# EAGLE design esp_all4 (EAGLE 7.7.0)
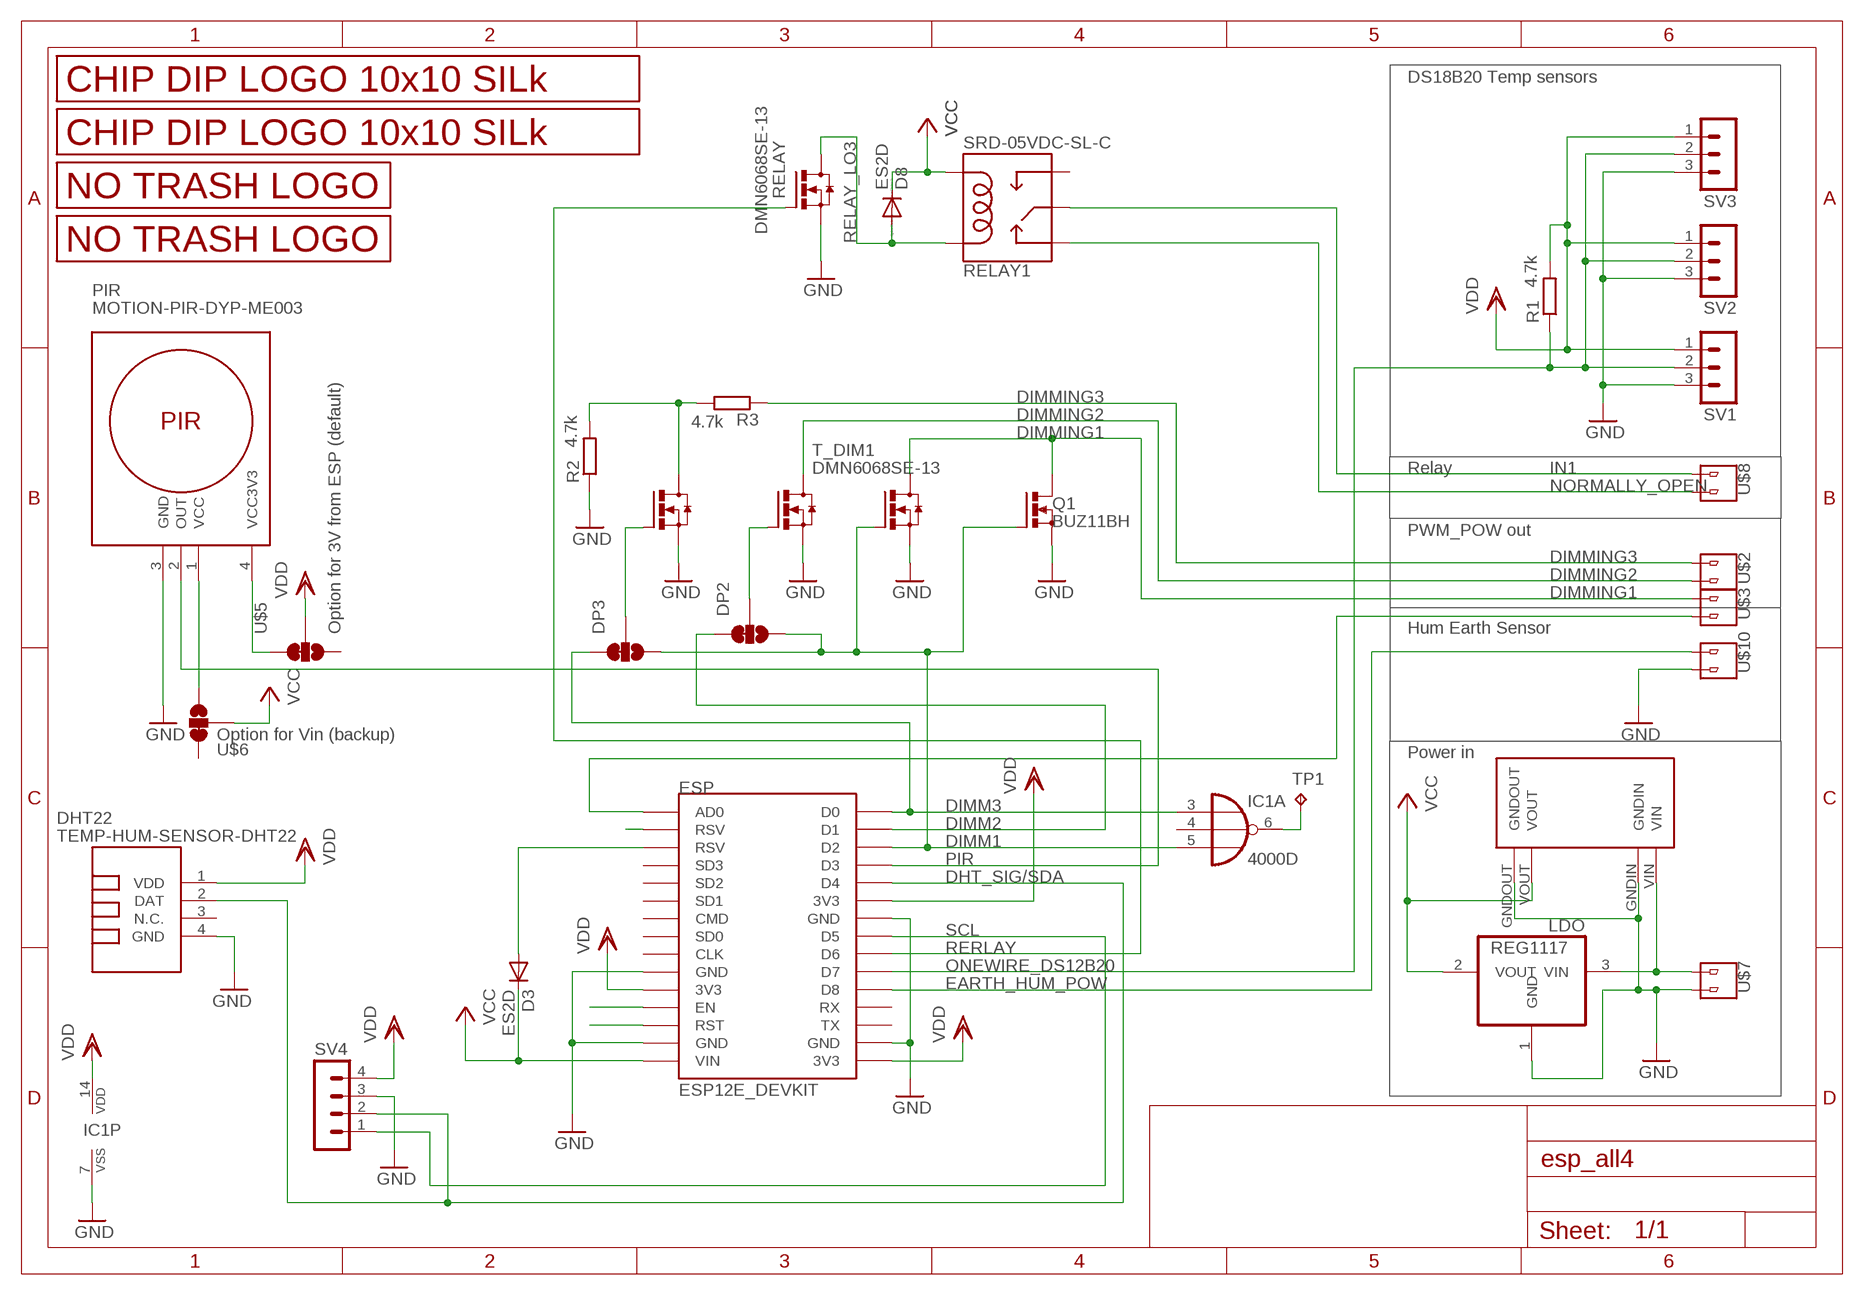
[diagram p0: schematic, sheet 1]

## Parts
D3  ES2D  [SMB]
D8  ES2D  DIODE-SMB  [SMB]
DHT22  TEMP-HUM-SENSOR-DHT22  [TEMP-HUM-SENSOR-DHT22]
DP2  SMD_SJ_3WAY_CLOSED  [SMD_SJ_3WAY_CLOSED]
DP3  SMD_SJ_3WAY_CLOSED  [SMD_SJ_3WAY_CLOSED]
ESP  ESP12E_DEVKIT  [ESP12E_DEVKIT]
IC1  4000D  [SO14]
LDO  REG1117  [SOT223]
PIR  MOTION-PIR-DYP-ME003  [MOTION-PIR-DYP-ME003]
Q1  BUZ11BH  [TO220BH]
R1  4.7k  R-EU_M0805  [M0805]
R2  4.7k  R-EU_M0805  [M0805]
R3  4.7k  R-EU_M0805  [M0805]
RELAY  DMN6068SE-13  NMOSFET_SMD_223  [SOT223]
RELAY1  SRD-05VDC-SL-C  RELAYPTH  [SRD-05VDC-SL-C]
SV1  MA03-1  [MA03-1]
SV2  MA03-1  [MA03-1]
SV3  MA03-1  [MA03-1]
SV4  MA04-1  [MA04-1]
T_DIM1  DMN6068SE-13  NMOSFET_SMD_223  [SOT223]
T_DIM2  DMN6068SE-13  NMOSFET_SMD_223  [SOT223]
T_DIM3  DMN6068SE-13  NMOSFET_SMD_223  [SOT223]
TP1  TPTP20SQ  [TP20SQ]
U$1  LOGO_10X10_SILK  [LOGO2_10X10_SILK]
U$2  V1  2_PIN_CONNECTOR  [2_SCREW_PIN]
U$3  V1  2_PIN_CONNECTOR  [2_SCREW_PIN]
U$4  LOGO_NO_TRASHNO_TRASH  [LOGO_ROHS_NO_TRASH]
U$5  SMD_SJ_3WAY_CLOSED  [SMD_SJ_3WAY_CLOSED]
U$6  SMD_SJ_3WAY_CLOSED  [SMD_SJ_3WAY_CLOSED]
U$7  V1  2_PIN_CONNECTOR  [2_SCREW_PIN]
U$8  V1  2_PIN_CONNECTOR  [2_SCREW_PIN]
U$9  LOGO_NO_TRASHROHS  [LOGO_ROHS_SYM]
U$10  V1  2_PIN_CONNECTOR  [2_SCREW_PIN]
U$11  LOGO_10X10_SILK  [LOGO2_10X10_SILK]
U$12  MP1584EN_FRAMELESS  [MP1584EN_FRAMELESS]

## Nets
DHT_SIG/SDA: DHT22.2(DAT) ESP.D4 ESP.D41(D4) SV4.2
DIMM1: DP2.3 DP3.3 ESP.D2 ESP.D21(D2) IC1.5(A:I2) Q1.G T_DIM1.1(G)
DIMM2: DP2.1 ESP.D1 ESP.D11(D1)
DIMM3: DP3.1 ESP.D0 ESP.D01(D0) IC1.3(A:I0)
DIMMING1: Q1.D T_DIM1.2(D) T_DIM1.4(D) U$3.P$1
DIMMING2: T_DIM2.2(D) T_DIM2.4(D) U$2.P$2
DIMMING3: R3.1 U$2.P$1
EARTH_HUM_POW: ESP.D8 ESP.D81(D8) U$10.P$1
GND: DHT22.4(GND) ESP.GND@0(GND) ESP.GND@1(GND) ESP.GND@2(GND) ESP.GND@3(GND) ESP.GND@4(GND) ESP.GND@5(GND) ESP.GND@6(GND) ESP.GND@7(GND) IC1.7(P:VSS) LDO.1(GND) PIR.3(GND) Q1.S R2.1 RELAY.3(S) SV1.3 SV2.3 SV3.3 SV4.3 T_DIM1.3(S) T_DIM2.3(S) T_DIM3.3(S) U$7.P$2 U$10.P$2 U$12.GNDIN U$12.GNDOUT
IN1: RELAY1.SWCOMMON U$8.P$1
N$1: ESP.AD0 ESP.AD1(AD0) U$3.P$2
N$2: ESP.RSV@0(RSV) ESP.RSV@01(RSV)
N$3: R2.2 R3.2 T_DIM3.2(D) T_DIM3.4(D)
N$4: IC1.6(A:O) TP1.TP
N$12: ESP.EN ESP.EN1(EN)
N$13: ESP.RST ESP.RST1(RST)
N$14: D3.A ESP.RSV@1(RSV) ESP.RSV@11(RSV)
N$17: LDO.3(VIN) U$7.P$1 U$12.VIN
N$20: DP3.2 T_DIM3.1(G)
N$21: DP2.2 T_DIM2.1(G)
N$24: PIR.4(VCC3V3) U$5.1
N$31: PIR.1(VCC) U$6.3
NORMALLY_OPEN: RELAY1.SWCLOSED(SWCLOSE) U$8.P$2
ONEWIRE_DS12B20: ESP.D7 ESP.D71(D7) R1.1 SV1.2 SV2.2 SV3.2
PIR: ESP.D3 ESP.D31(D3) PIR.2(OUT)
RELAY_LO3: D8.A RELAY1.COIL1 RELAY.2(D) RELAY.4(D)
RERLAY: ESP.D6 ESP.D61(D6) RELAY.1(G)
SCL: ESP.D5 ESP.D51(D5) SV4.1
VCC: D3.C D8.C ESP.VIN ESP.VIN1(VIN) LDO.2(VOUT) RELAY1.COIL0 U$6.2 U$12.VOUT
VDD: DHT22.1(VDD) ESP.3V3@0(3V3) ESP.3V3@1(3V3) ESP.3V3@2(3V3) ESP.3V3@3(3V3) ESP.3V3@4(3V3) ESP.3V3@5(3V3) IC1.14(P:VDD) R1.2 SV1.1 SV2.1 SV3.1 SV4.4 U$5.2
Unconnected: DHT22.3(N.C.) ESP.CLK ESP.CLK1(CLK) ESP.CMD ESP.CMD1(CMD) ESP.RX ESP.RX1(RX) ESP.SD0 ESP.SD1 ESP.SD01(SD0) ESP.SD2 ESP.SD3 ESP.SD12(SD1) ESP.SD22(SD2) ESP.SD32(SD3) ESP.TX ESP.TX1(TX) IC1.4(A:I1) IC1.8(C:I) IC1.9(C:O) IC1.10(B:O) IC1.11(B:I2) IC1.12(B:I1) IC1.13(B:I0) RELAY1.SWOPEN U$5.3 U$6.1

## Notes on the sheet
- DS18B20 Temp sensors
- Relay
- PWM_POW out
- Option for 3V from ESP (default) | Hum Earth Sensor
- Option for Vin (backup)
- Power in

## Library data of the parts
D3 = diode:ES2D: DIODE super fast rectifier, 2 A
D8 = diode:DIODE-: DIODE
DHT22 = diy-modules:TEMP-HUM-SENSOR-DHT22: DHT22 - digital humidity & temperature sensor Also known as: AM2302 AM2302 datasheet available here: http://akizukidenshi.com/download/ds/aosong/AM2302.pdf Click here to find device on ebay.com <http://www.ebay.com/sch/dht22+digital+sensor>
DP2 DP3 U$5 U$6 = JKW_CHIP:SMD_SJ_3WAY_CLOSED
ESP = ESP12E_DEVKIT:ESP12E_DEVKIT: ESP12E DEVKIT BOARD
IC1 = 40xx:4000: Dual 3-input NOR & INVERTER
LDO = burr-brown:REG1117: 800mA and 1A Low Dropout (LDO) Positive Regulator 1.8V, 2.5V, 2.85V, 3.3V, 5V, and Adj; MPN: REG1117; OC_FARNELL: 1097566; OC_NEWARK: 14P6981
PIR = diy-modules:MOTION-PIR-DYP-ME003: PIR Motion Sensor Module DYP-ME003 based on BISS0001 pyroelectic detector Click here to find device on ebay.com <http://www.ebay.com/sch/dyp+me003>
Q1 = transistor-power:BUZ11: N-CHANNEL MOS FET
R1-R3 = rcl:R-EU_: RESISTOR, European symbol
RELAY T_DIM1-T_DIM3 = transistor-power:NMOSFET_SMD_223
RELAY1 = JKW_CHIP:RELAY: SPDT relay (COM-00101)
SV1-SV3 = con-lstb:MA03-1: PIN HEADER; OC_FARNELL: unknown; OC_NEWARK: unknown
SV4 = con-lstb:MA04-1: PIN HEADER; OC_FARNELL: unknown; OC_NEWARK: unknown
TP1 = testpad:TP: Test pad
U$1 U$11 = JKW_CHIP:LOGO_10X10_SILK
U$2 U$3 U$7 U$8 U$10 = JKW_CHIP:2_PIN_CONNECTOR
U$4 U$9 = JKW_CHIP:LOGO_NO_TRASH
U$12 = JKW_CHIP:MP1584EN_FRAMELESS

## Board
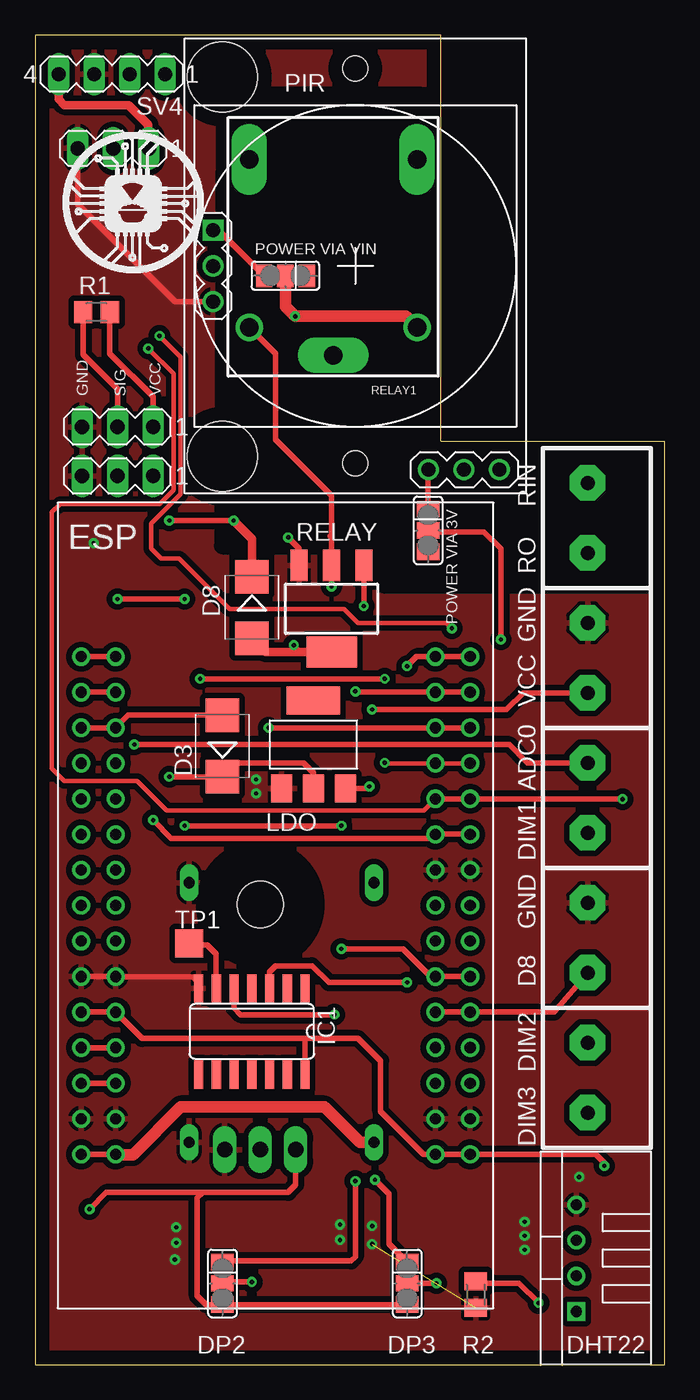
[diagram p1: board, top side]
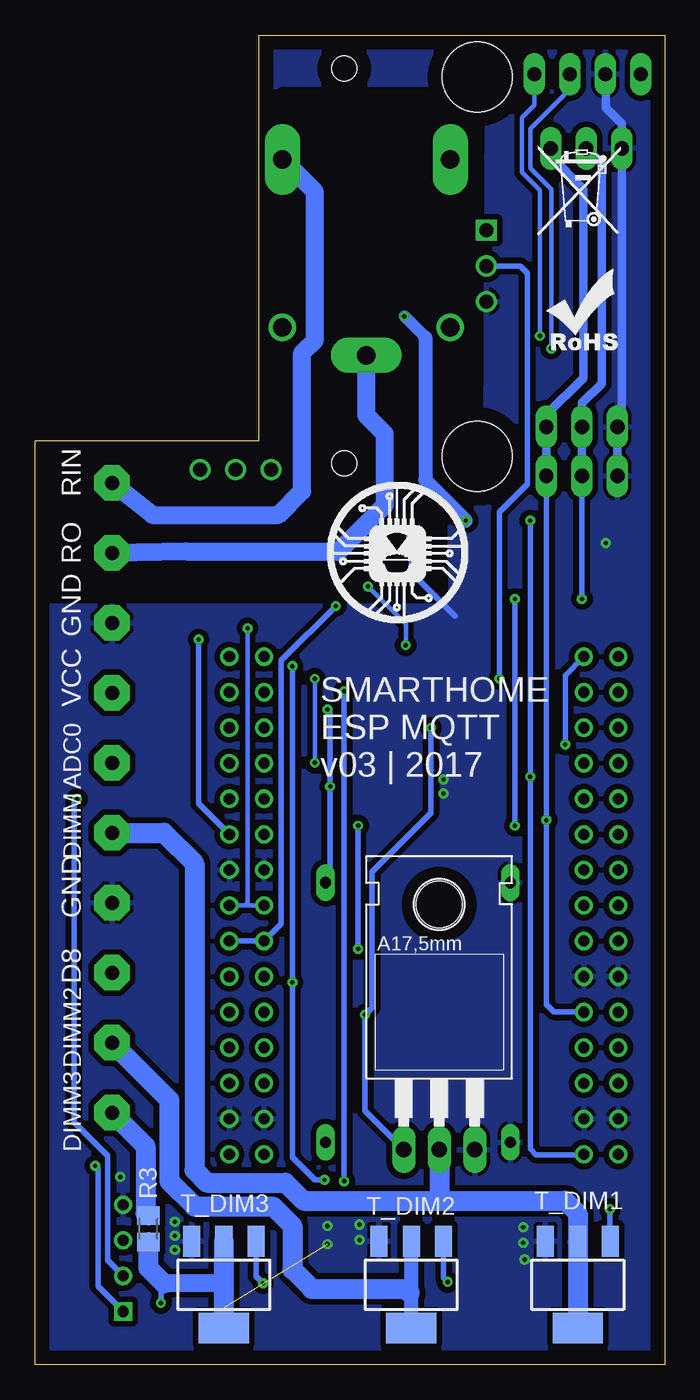
[diagram p2: board, bottom side, seen from below]

Size 45 x 95 mm. Coordinates in mm from the lower left corner, seen from the top.
Outline: 0,0 45,0 45,66 29,66 29,95 0,95 0,0
Copper layers (1*16): Top 0.035mm / dielectric 1.5mm / Bottom 0.035mm
Design rules "default": minimum track width 10mil, minimum drill 24mil, track to track 8mil, track to pad 8mil, pad to pad 8mil, via to via 8mil, smd to smd 8mil, copper to edge 40mil, drill to drill 8mil, minimum pad ring 10mil, minimum via ring 8mil, stop-mask expansion 4mil, vias tented up to drill 0mil, thermal gap 10mil
Holes 5 mm at 13.4,64.9 13.4,92
tRestrict: area 13.4,55.7 to 44.4,90.7
bRestrict: area 13.5,55 to 44.2,90.7

### Footprints (pad centres in the part's own frame; a part is rotated, then mirrored left to right if it is on the bottom)
SMB = smd 2.4 x 2.4: A 2.2,0; C -2.2,0
TEMP-HUM-SENSOR-DHT22 = drill 0.8 square: 1 -3.81,0 | drill 0.8: 2 -1.27,0; 3 1.27,0; 4 3.81,0
SMD_SJ_3WAY_CLOSED = smd 1.168 x 1.6: 1 -1.524,0; 2 0,0; 3 1.524,0
ESP12E_DEVKIT = drill 0.8: 3V3@0 -11.43,-7.62; 3V3@1 11.43,5.08; 3V3@2 11.43,-17.78; 3V3@3 -13.9,-7.62; 3V3@4 13.9,5.08; 3V3@5 13.9,-17.78; AD0 -11.43,17.78; AD1 -13.9,17.78; CLK -11.43,-2.54; CLK1 -13.9,-2.54; CMD -11.43,2.54; CMD1 -13.9,2.54; D0 11.43,17.78; D1 11.43,15.24; D01 13.9,17.78; D2 11.43,12.7; D3 11.43,10.16; D4 11.43,7.62; D5 11.43,0; D6 11.43,-2.54; D7 11.43,-5.08; D8 11.43,-7.62; D11 13.9,15.24; D21 13.9,12.7; D31 13.9,10.16; D41 13.9,7.62; D51 13.9,0; D61 13.9,-2.54; D71 13.9,-5.08; D81 13.9,-7.62; EN -11.43,-10.16; EN1 -13.9,-10.16; GND@0 -11.43,-5.08; GND@1 -11.43,-15.24; GND@2 11.43,2.54; GND@3 11.43,-15.24; GND@4 -13.9,-15.24; GND@5 -13.9,-5.08; GND@6 13.9,2.54; GND@7 13.9,-15.24; RST -11.43,-12.7; RST1 -13.9,-12.7; RSV@0 -11.43,15.24; RSV@1 -11.43,12.7; RSV@01 -13.9,15.24; RSV@11 -13.9,12.7; RX 11.43,-10.16; RX1 13.9,-10.16; SD0 -11.43,0; SD1 -11.43,5.08; SD01 -13.9,0; SD2 -11.43,7.62; SD3 -11.43,10.16; SD12 -13.9,5.08; SD22 -13.9,7.62; SD32 -13.9,10.16; TX 11.43,-12.7; TX1 13.9,-12.7; VIN -11.43,-17.78; VIN1 -13.9,-17.78
SO14 = smd 0.66 x 2.032: 1 -3.81,-3.073; 2 -2.54,-3.073; 3 -1.27,-3.073; 4 0,-3.073; 5 1.27,-3.073; 6 2.54,-3.073; 7 3.81,-3.073; 8 3.81,3.073; 9 2.54,3.073; 10 1.27,3.073; 11 0,3.073; 12 -1.27,3.073; 13 -2.54,3.073; 14 -3.81,3.073
SOT223 = smd 1.499 x 2.007: 1 -2.261,-3.15; 2 0.025,-3.15; 3 2.311,-3.15 | smd 3.81 x 2.007: 4 0,3.15
MOTION-PIR-DYP-ME003 = drill 1 square: 1 -2.54,-10.16 | drill 1: 2 0,-10.16; 3 2.54,-10.16; 4 14.54,5.23; 5 14.54,7.77; 6 14.54,10.31 | hole 1.8: -14.1,0; 14.1,0
TO220BH = drill 1.118 long: D 0,-6.35; G -2.54,-6.35; S 2.54,-6.35 | hole 3.302: 0,11.176
M0805 = smd 1.3 x 1.6: 1 -0.95,0; 2 0.95,0
SOT223' = smd 1.219 x 2.235: 1 -2.311,-3.099; 2 0,-3.099; 3 2.311,-3.099 | smd 3.6 x 2.2: 4 0,3.099
SRD-05VDC-SL-C = drill 1.3: COIL0 -5.39,-6.12; COIL1 -5.39,5.88 | drill 1.3 pad 2.54 long: SWCLOSED 6.61,-6.12; SWCOMMON -7.39,-0.12; SWOPEN 6.61,5.88
MA03-1 = drill 1.016 long: 1 -2.54,0; 2 0,0; 3 2.54,0
MA04-1 = drill 1.016 long: 1 -3.81,0; 2 -1.27,0; 3 1.27,0; 4 3.81,0
TP20SQ = smd 2 x 2: TP 0,0
2_SCREW_PIN = drill 1 pad 2.54 octagon: P$1 -2.5,0.5; P$2 2.5,0.5
MP1584EN_FRAMELESS = drill 0.8 long: GNDIN 1.778,14.986; GNDOUT 20.32,14.986; VIN 1.778,1.778; VOUT 20.32,1.778

### Placement (x,y rotation side)
D3  13.4,44.2 90 top
D8  15.5,54.1 270 top
DHT22  38.7,7.6 90 top
DP2  13.4,5.8 270 top
DP3  26.6,5.8 270 top
ESP  17.2,32.8 0 top
IC1  15.5,23.8 180 top
LDO  19.9,44.3 0 top
PIR  22.9,78.5 270 top
Q1  16.1,21.7 0 bottom
R1  4.4,75.2 0 top
R2  31.5,5 90 top
R3  36.9,9.7 270 bottom
RELAY  DMN6068SE-13  [SOT223']  21.2,54 180 top
RELAY1  21.2,79.5 90 top
SV1  5.6,86.9 180 top
SV2  5.9,67 180 top
SV3  5.9,63.5 180 top
SV4  5.5,92.2 180 top
T_DIM1  DMN6068SE-13  [SOT223']  6.2,5.7 180 bottom
T_DIM2  DMN6068SE-13  [SOT223']  18.1,5.7 180 bottom
T_DIM3  DMN6068SE-13  [SOT223']  31.5,5.7 180 bottom
TP1  11,30.1 0 top
U$1  24.1,53 0 bottom
U$2  40,20.5 90 top
U$3  40,40.5 90 top
U$4  9.1,80.7 0 bottom
U$5  28.1,59.6 270 top
U$6  17.9,77.8 180 top
U$7  40,50.5 90 top
U$8  40,60.5 90 top
U$9  8.9,72.4 0 bottom
U$10  40,30.5 90 top
U$11  2,78 0 top
U$12  26,36.2 270 bottom

### Tracks (layer width: path | path; a pad name or v marks a point on that pad's centre or on a via)
DHT_SIG/SDA  (via drill 0.3)
  Top 0.305: v8.1,72.6 9.9,70.8 9.9,62.5 8.9,61.5 1.8,61.5 1.2,60.9 1.2,42.6 2.1,41.7 7.3,41.7 9.4,39.6 27.81,39.6 ESP.D4
  Top 0.406: ESP.D41 30.6,40.42 | 30.6,40.42 ESP.D4 | v42,40.4 30.62,40.4 30.6,40.42
  Bottom 0.305: SV4.2 6.77,91.13 9.6,88.3 9.6,85.5 8.1,84 v8.1,72.6
  Bottom 0.406: v42,40.4 42.2,40.2 42.2,17.3 39.8,14.9 39.8,7.43 DHT22.2
DIMM1  (via drill 0.3)
  Top 0.406: ESP.D21 ESP.D2 v16.7,45.5 | DP3.3 DP2.3 12.22,4.28 11.6,4.9 11.6,11.9 12,12.3 | Q1.G 18.64,12.84 18.1,12.3 12,12.3 | 12,12.3 5.1,12.3 v3.9,11.1 | IC1.5 14.23,25.47 14.7,25 v21.4,25
  Bottom 0.406: v16.7,45.5 16.7,39.4 20.9,35.2 20.9,25.5 v21.4,25 21.4,18.11 Q1.G | v3.9,11.1 T_DIM1.1
DIMM2  (via drill 0.3)
  Top 0.406: ESP.D11 ESP.D1 22.96,48.04 v22.9,48.1 | v22.9,13.1 22.9,7.7 22.6,7.4 13.48,7.4 DP2.1
  Bottom 0.406: v22.9,48.1 v22.9,13.1
DIMM3  (via drill 0.3)
  Top 0.406: ESP.D01 ESP.D0 27.28,50.58 v26.6,49.9 | DP3.1 25.3,8.62 25.3,12.2 v24.3,13.2 | IC1.3 16.77,28.07 17.2,28.5 19.8,28.5 21,27.3 v26.6,27.3 26.5,27.3
  Bottom 0.406: v26.6,49.9 v26.6,27.3 26.6,14.8 25,13.2 v24.3,13.2
DIMMING1
  Bottom 1.422: U$3.P$1 35.8,38 33.6,35.8 33.6,13.9 32.7,13 27.1,13 25.8,11.7 16.2,11.7 | 16.2,11.7 7.1,11.7 6.2,10.8 T_DIM1.2 T_DIM1.4 | Q1.D 16.1,11.8 16.2,11.7
DIMMING2
  Bottom 0.406: 23.2,5.5 23.1,5.4
  Bottom 1.016: 18.2,5.1 18.1,5.2 | 18.1,5.2 T_DIM2.2 | T_DIM2.4 18.1,5.2
  Bottom 1.422: U$2.P$2 35.4,18.9 35.4,13.1 33.6,11.3 28,11.3 26.6,9.9 26.6,6.8 25.2,5.4 23.1,5.4 18.5,5.4 18.2,5.1
DIMMING3
  Bottom 1.422: U$2.P$1 37.1,15.6 37.1,10.8 37,10.7 R3.1
EARTH_HUM_POW
  Top 0.406: ESP.D8 ESP.D81 37.12,25.18 U$10.P$1
GND  (via drill 0.3, 0.31)  (1 unrouted)
  Top 0.406: PIR.3 10,75.96 3.06,82.9 SV1.3 | IC1.7 11.69,27.31 11.3,27.7 5.79,27.7 ESP.GND@0 ESP.GND@5 | RELAY.3 18.89,58.31 v18.1,59.1
  Bottom 0.406: v18.1,59.1 18.1,56.6 15,53.5
  Bottom 0.61: SV3.3 SV2.3 3.06,67.3 SV1.3 3.06,88.66 4.2,89.8 4.2,92.17 SV4.3
  other vias: 4.2,58.7 38.9,13.4 35,10.2 35,9.2 35,8.2 10.1,9.8 10.1,8.7 10,7.5 21.8,10 21.8,8.9 24.1,9.9 24.1,8.6 15.8,40.8 15.8,41.8
  pour Top (isolate 0.406, rank 6): 8.4,94.7 28.6,94.7 28.6,65.7 44.7,65.7 44.7,0.4 0.1,0.4 0.1,94.4 8.5,94.4
  pour Bottom (isolate 0.406): 9.1,94.2 28.6,94.2 28.6,64.9 44.7,64.9 44.7,0.4 0.1,0.4 0.1,93.9 8.7,93.9
IN1
  Bottom 1.27: U$8.P$1 34.2,58.1 23.3,58.1 20,61.4 20,66.5 21.32,67.82 RELAY1.SWCOMMON
N$1  (via drill 0.3)
  Top 0.406: ESP.AD1 ESP.AD0 | U$3.P$2 35.2,43 33.9,44.3 v7.1,44.3
  Bottom 0.406: v7.1,44.3 7.1,49.25 ESP.AD0
N$2
  Top 0.406: ESP.RSV@01 ESP.RSV@0
N$3  (via drill 0.3)
  Top 0.406: R2.2 31.65,5.8 34.6,5.8 v36,4.4
  Bottom 0.406: v36,4.4 36,5.6 35.8,5.8
  Bottom 1.27: 31.8,5.8 35.8,5.8
  Bottom 1.422: R3.2 36.9,6.9 35.8,5.8 | 31.8,5.8 31.5,6.1 | 31.5,6.1 T_DIM3.2 | T_DIM3.4 31.5,6.1
N$4
  Top 0.406: IC1.6 12.96,29.34 12.3,30 11.1,30 TP1.TP
N$12
  Top 0.406: ESP.EN1 ESP.EN
N$13
  Top 0.406: ESP.RST1 ESP.RST
N$14
  Top 0.406: ESP.RSV@11 ESP.RSV@1 6.67,46.4 D3.A
N$17  (via drill 0.3)
  Top 0.406: LDO.3 23.75,41.15 v23.9,41.3 | v24.1,46.8 33.7,46.8 34.9,48 U$7.P$1
  Bottom 0.406: v24.1,46.8 23.9,46.6 23.9,41.9 v23.9,41.3 23.9,34.42 U$12.VIN
N$20  (via drill 0.3)
  Top 0.406: v28.7,5.8 DP3.2
  Bottom 0.406: T_DIM3.1 29.19,6.29 v28.7,5.8
N$21  (via drill 0.3)
  Top 0.406: v15.5,5.9 13.5,5.9 DP2.2
  Bottom 0.406: T_DIM2.1 15.79,6.19 v15.5,5.9
N$24
  Top 0.406: U$5.1 28.1,63.93 PIR.4
N$31
  Top 0.406: PIR.1 13.14,81.04 U$6.3
NORMALLY_OPEN
  Bottom 1.27: U$8.P$2 36.6,60.7 27.6,60.7 25.9,62.4 25.9,72.29 25,73.19 25,83.79 RELAY1.SWCLOSED
ONEWIRE_DS12B20  (via drill 0.3)
  Top 0.406: R1.1 3.45,72.15 5.9,69.7 SV2.2 5.9,66.5 | ESP.D71 ESP.D7 28.28,27.72 26.3,29.7 v21.9,29.7 | v21.9,38.5 v10.7,38.5 | v10.7,54.7 v5.9,54.7
  Bottom 0.406: v21.9,29.7 v21.9,38.5 | v10.7,38.5 v10.7,54.7 | v5.9,54.7 SV3.2
  Bottom 0.61: SV3.2 SV2.2 5.9,68.7 4.5,70.1 4.5,85.8 SV1.2
PIR  (via drill 0.3)
  Top 0.305: ESP.D31 ESP.D3 25.04,42.96 v25,43
  Top 0.406: v25,49 v11.8,49
  Bottom 0.305: v25,43 v25,49
  Bottom 0.406: v11.8,49 11.8,60.9 9.8,62.9 9.8,78 10.3,78.5 PIR.2
RELAY_LO3  (via drill 0.3)
  Top 0.305: RELAY.4 19,50.9 v18.5,51.4 | v21.2,55.6 RELAY.2
  Top 0.406: RELAY.2 21.2,59.1 | 21.1,59.2 21.2,59.1 | 21.2,59.1 21.2,62.1 17.2,66.1 17.2,72.23 RELAY1.COIL1
  Top 0.61: D8.A 16.5,50.9 RELAY.4
  Bottom 0.305: v18.5,51.4 18.5,52.9 v21.2,55.6
RERLAY  (via drill 0.3)
  Top 0.406: v23.5,54.2 23.5,57.09 RELAY.1
  Bottom 0.406: v23.5,54.2 27.4,50.3 27.4,31.49 ESP.D6 ESP.D61
SCL  (via drill 0.3)
  Top 0.305: v8.9,73.5 10.4,72 10.4,62.2 8.3,60.1 8.3,58.3 9,57.6 10.3,57.6 13.9,54 22.1,54 23.1,53 29.4,53 v29.8,52.6
  Bottom 0.305: SV4.1 9.31,89.99 10.2,89.1 10.2,85.2 8.9,83.9 v8.9,73.5 | 30,32.8 ESP.D51 | ESP.D5 30,32.8 | 30,32.8 29.8,33 v29.8,52.6
VCC  (via drill 0.3, 0.31)
  Top 0.406: ESP.VIN ESP.VIN1 | 14.25,41.15 D3.C | D3.C v9.6,42 | v9.6,60.3 v14.2,60.3 | LDO.2 19.93,42.27 19.2,43 14.4,43 D3.C
  Top 0.61: D8.C 15.5,59 v14.2,60.3
  Top 0.813: RELAY1.COIL0 26.53,74.9 v18.6,74.9 17.9,75.6 U$6.2 | U$12.VOUT 23.22,15.88 20.7,18.4 10.4,18.4 7,15 5.79,15 ESP.VIN
  Bottom 0.406: ESP.VIN 5.79,15 9.2,15 9.6,15.4 v9.6,42 v9.6,60.3
  Bottom 0.61: 3.28,15 ESP.VIN1
  Bottom 0.813: 17.1,73.4 v18.6,74.9
  Bottom 1.016: 17.1,73.4 17.1,63.2 v14.2,60.3
VDD  (via drill 0.3)
  Top 0.406: R1.2 5.35,72.25 8.44,69.16 SV2.1 | ESP.3V3@3 ESP.3V3@0 7.65,23.3 19.2,23.3 | v33.3,51.8 33.3,58.3 32.1,59.5 28.2,59.5 U$5.2 | ESP.3V3@4 31.1,37.9 28.65,37.9 ESP.3V3@1 28.35,37.6 9.74,37.6 v8.44,38.9 | 19.3,20.72 IC1.14 19.31,23.19 19.2,23.3 | v40.7,14.2 40.7,14.4 40.08,15.02 ESP.3V3@5 ESP.3V3@2 27.78,15.02 24.7,18.1 24.7,21.7 23.1,23.3 19.2,23.3
  Top 0.61: SV4.4 1.69,90.41 2.1,90 6.7,90 8.1,88.6 8.1,86.94 SV1.1
  Bottom 0.406: v33.3,51.8 33.3,40.08 ESP.3V3@4 | SV3.1 v8.44,38.9 8.44,25.74 7.9,25.2 5.79,25.2 ESP.3V3@0 | DHT22.1 40.5,5.59 40.5,14 v40.7,14.2
  Bottom 0.61: SV3.1 SV2.1 8.44,67.86 5.8,70.5 5.8,84 8.14,86.34 SV1.1

### Text on the board
tNames: POWER VIA VIN | GND | SIG | VCC | POWER VIA 3V | RIN | RO | GND | VCC | ADC0 | DIM1 | GND | D8 | DIM2 | DIM3
bNames: RIN | RO | GND | VCC | SMARTHOME / ESP MQTT / v03 | 2017 | ADC0 | DIMM | GND | D8 | DIMM2 | DIMM3